# Altium project POVRotor.PrjPcb
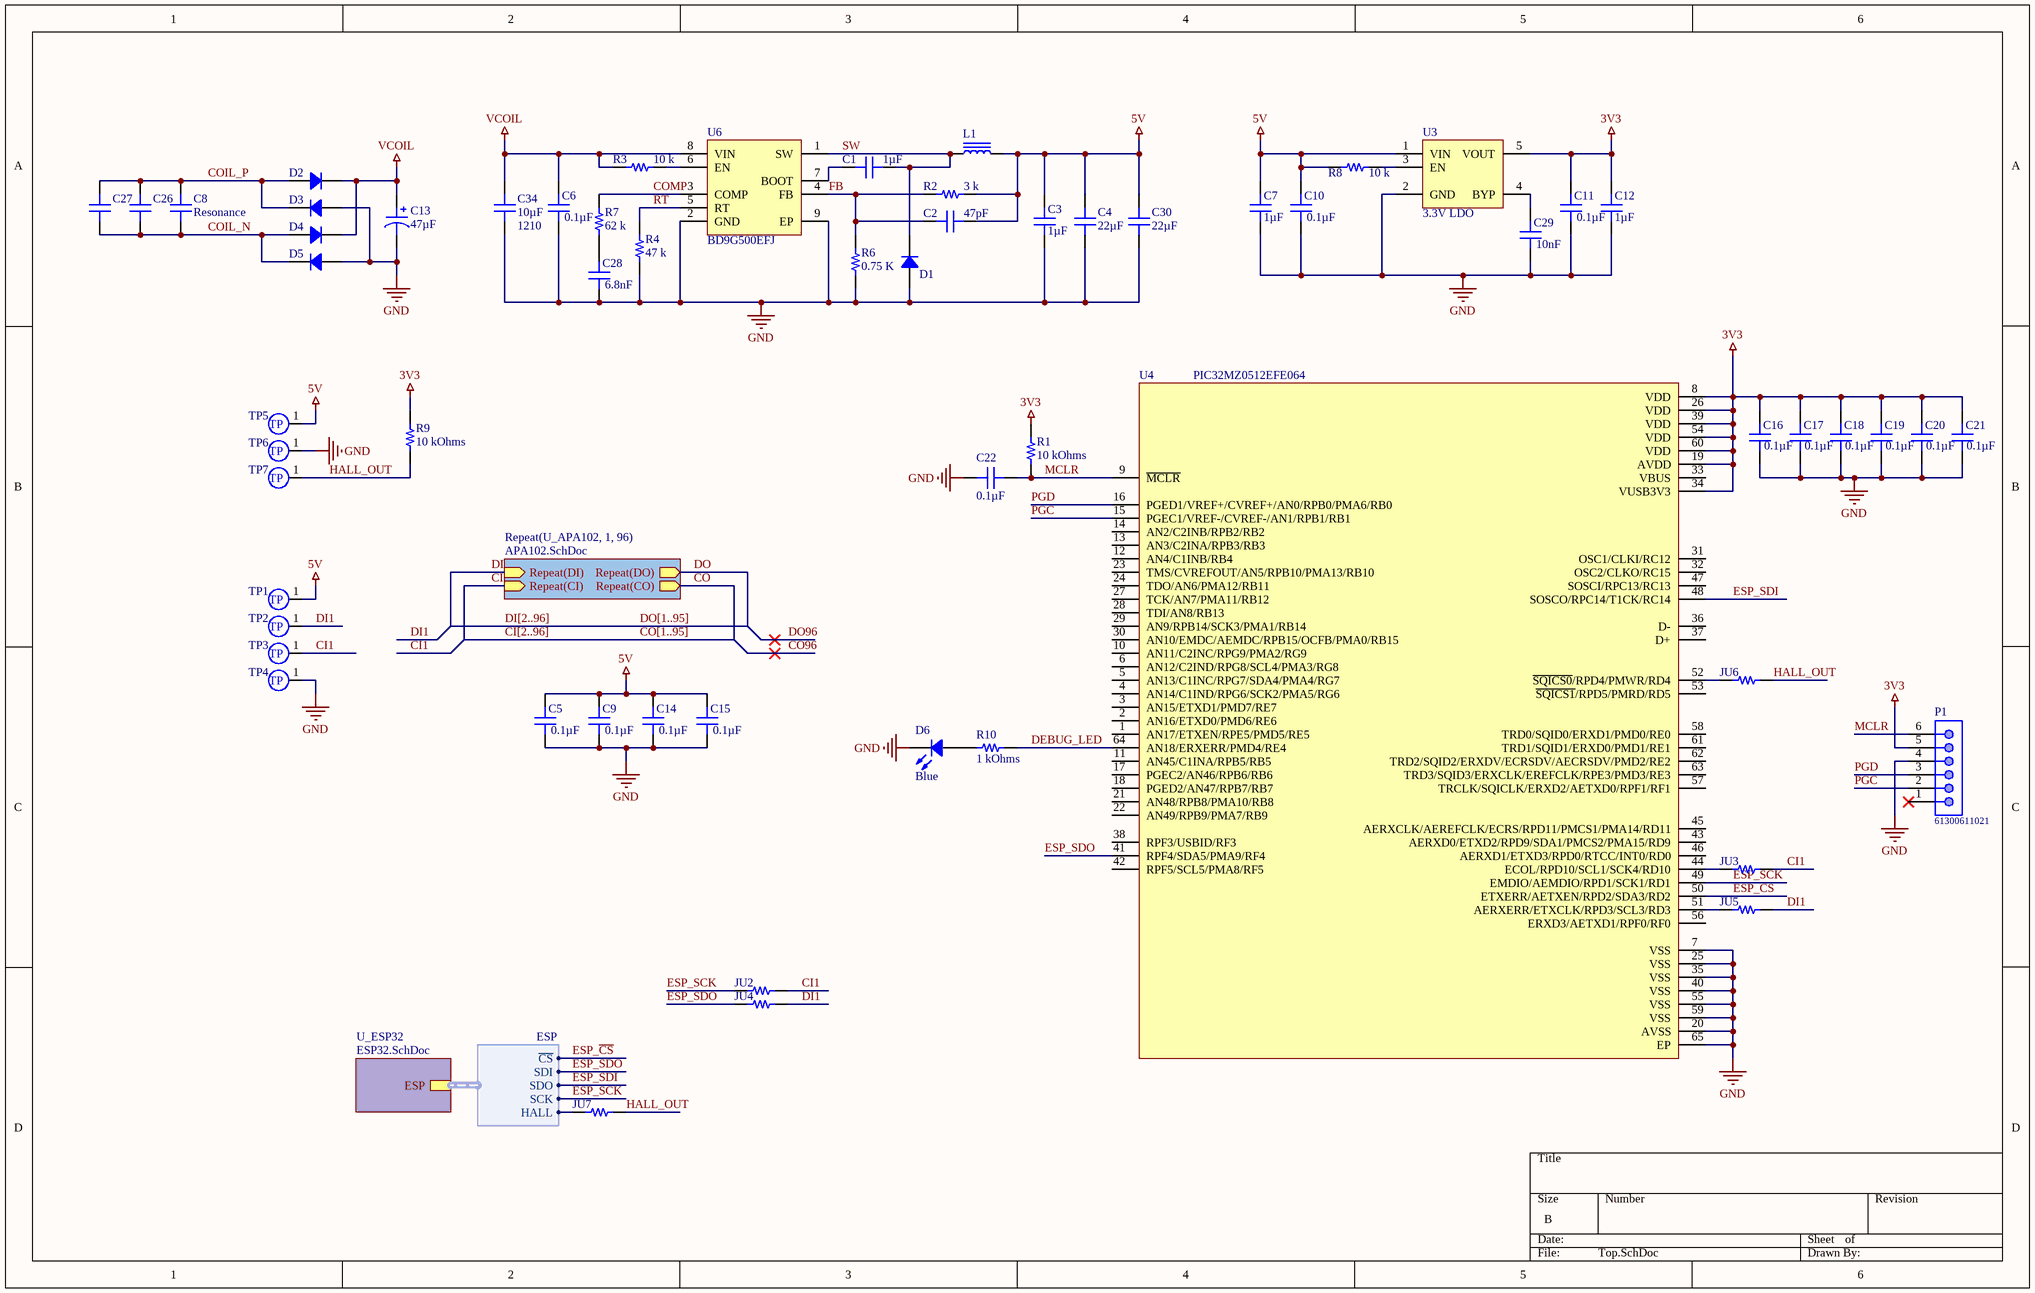
[diagram p0: Top.SchDoc]
2 sheets, 69 parts. Net scope: hierarchical (ports join the sheet entries above them; power ports are global).
Board file: POVRotor.PcbDoc
Sheets:
  Top.SchDoc
    U_ESP32 = ESP32.SchDoc

## Sheet Top.SchDoc
size B

### Parts
C1  1µF  [CAP 0603_1608]
C2  47pF  [CAP 0603_1608]
C3  1µF  [CAP 0603_1608]
C4  22µF  [CAP 0805_2012]
C5  0.1µF  [CAP 0603_1608]
C6  0.1µF  [CAP 0603_1608]
C7  1µF  [CAP 0603_1608]
C8  Resonance  [CAP 1206_3216 - 1.8MM]
C9  0.1µF  [CAP 0603_1608]
C10  0.1µF  [CAP 0603_1608]
C11  0.1µF  [CAP 0603_1608]
C12  1µF  [CAP 0603_1608]
C13  47µF  [CAP ALSMD 6.6MM H6.1MM]
C14  0.1µF  [CAP 0603_1608]
C15  0.1µF  [CAP 0603_1608]
C16  0.1µF  [CAP 0603_1608]
C17  0.1µF  [CAP 0603_1608]
C18  0.1µF  [CAP 0603_1608]
C19  0.1µF  [CAP 0603_1608]
C20  0.1µF  [CAP 0603_1608]
C21  0.1µF  [CAP 0603_1608]
C22  0.1µF  [CAP 0603_1608]
C26  Resonance  [CAP 1206_3216 - 1.8MM]  (value not drawn)
C27  Resonance  [CAP 1206_3216 - 1.8MM]  (value not drawn)
C28  6.8nF  [CAP 0603_1608]
C29  10nF  [CAP 0603_1608]
C30  22µF  [CAP 0805_2012]
C34  Device Package: 1210  [CAP 1210_3225 - 2.8MM]  (hidden comment: 10µF)
D1  STPS340UY  [DO214AA SMB]  (value not drawn)
D2  STPS340UY  [DO214AA SMB]  (value not drawn)
D3  STPS340UY  [DO214AA SMB]  (value not drawn)
D4  STPS340UY  [DO214AA SMB]  (value not drawn)
D5  STPS340UY  [DO214AA SMB]  (value not drawn)
D6  Blue  [LED 0603_1608 GREEN]
JU2  (no value)  [RES 0805_2012]
JU3  (no value)  [RES 0805_2012]
JU4  (no value)  [RES 0805_2012]
JU5  (no value)  [RES 0805_2012]
JU6  (no value)  [RES 0805_2012]
JU7  (no value)  [RES 0805_2012]
L1  MPL-AL5050-5R6  [MPL-AL5050-5R6]  (value not drawn)
P1  61300611021  [61300611021]
R1  10 kOhms  [RES 0603_1608]
R2  3 k  [RES 0603_1608]
R3  10 k  [RES 0603_1608]
R4  47 k  [RES 0603_1608]
R6  0.75 K  [RES 0603_1608]
R7  62 k  [RES 0603_1608]
R8  10 k  [RES 0603_1608]
R9  10 kOhms  [RES 0603_1608]
R10  1 kOhms  [RES 0603_1608]
TP1  TP  [TP]  (value not drawn)
TP2  TP  [TP]  (value not drawn)
TP3  TP  [TP]  (value not drawn)
TP4  TP  [TP]  (value not drawn)
TP5  TP  [TP]  (value not drawn)
TP6  TP  [TP]  (value not drawn)
TP7  TP  [TP]  (value not drawn)
U3  3.3V LDO  [TI SOT-23-5 DBV]
U4  PIC32MZ0512EFE064  [QFN50P900X900X100-65N]
U6  BD9G500EFJ  [SOP127P600X100-9N]

### Sub-sheets
Repeat(U_APA102, 1, 96) = APA102.SchDoc (file not in this document): Repeat(DI) (in), Repeat(CI) (in), Repeat(CO) (out), Repeat(DO) (out)
U_ESP32 = ESP32.SchDoc: ESP (harness ESP)

### Harnesses
ESP: ~{CS}, SDI, SDO, SCK, HALL

### Nets
3V3: C11.1 C12.2 C16.1 C17.1 C18.1 C19.1 C20.1 C21.1 P1.5 R1.2 R9.2 U3.5(VOUT) U4.8(VDD) U4.19(AVDD) U4.26(VDD) U4.34(VUSB3V3) U4.39(VDD) U4.54(VDD) U4.60(VDD)
5V: C2.1 C3.2 C4.2 C5.1 C7.2 C9.1 C10.1 C14.1 C15.1 C30.2 L1.2 R2.2 R8.2 TP1.1(TP) TP5.1(TP) U3.1(VIN)
GND: C3.1 C4.1 C5.2 C6.2 C7.1 C9.2 C10.2 C11.2 C12.1 C13.2 C14.2 C15.2 C16.2 C17.2 C18.2 C19.2 C20.2 C21.2 C22.2 C28.2 C29.2 C30.1 C34.2 D1.1 D3.1 D5.1 D6.2 P1.4 R4.2 R6.1 TP4.1(TP) TP6.1(TP) U3.2(GND) U4.7(VSS) U4.20(AVSS) U4.25(VSS) U4.35(VSS) U4.40(VSS) U4.55(VSS) U4.59(VSS) U4.65(EP) U6.2(GND) U6.9(EP)
VCOIL: C6.1 C13.1 C34.1 D2.2 D4.2 R3.2 U6.8(VIN)
CI: sheet Repeat(U_APA102, 1, 96)/Repeat(CI)
CI1: JU2.1 JU3.1 TP3.1(TP)
CO: sheet Repeat(U_APA102, 1, 96)/Repeat(CO)
COIL_N: C8.1 C26.1 C27.1 D4.1 D5.2
COIL_P: C8.2 C26.2 C27.2 D2.1 D3.2
COMP: R7.1 U6.3(COMP)
DEBUG_LED: R10.1 U4.64(AN18/ERXERR/PMD4/RE4)
DI: sheet Repeat(U_APA102, 1, 96)/Repeat(DI)
DI1: JU4.1 JU5.1 TP2.1(TP)
DO: sheet Repeat(U_APA102, 1, 96)/Repeat(DO)
ESP_~{CS}: U4.50(ETXERR/AETXEN/RPD2/SDA3/RD2) ; sheet U_ESP32/ESP.~{CS}  [project net ~{CS}]
ESP_HALL: JU7.2 ; sheet U_ESP32/ESP.HALL
ESP_SCK: JU2.2 U4.49(EMDIO/AEMDIO/RPD1/SCK1/RD1) ; sheet U_ESP32/ESP.SCK
ESP_SDI: U4.48(SOSCO/RPC14/T1CK/RC14) ; sheet U_ESP32/ESP.SDO
ESP_SDO: JU4.2 U4.41(RPF4/SDA5/PMA9/RF4) ; sheet U_ESP32/ESP.SDI
FB: C2.2 R2.1 R6.2 U6.4(FB)
HALL_OUT: JU6.1 JU7.1 R9.1 TP7.1(TP)
MCLR: C22.1 P1.6 R1.1 U4.9(~{MCLR})
PGC: P1.2 U4.15(PGEC1/VREF-/CVREF-/AN1/RPB1/RB1)
PGD: P1.3 U4.16(PGED1/VREF+/CVREF+/AN0/RPB0/PMA6/RB0)
RT: R4.1 U6.5(RT)
SW: C1.2 D1.2 L1.1 U6.1(SW)
NetC1_1: C1.1 U6.7(BOOT)
NetC28_1: C28.1 R7.2
NetC29_1: C29.1 U3.4(BYP)
NetD6_1: D6.1 R10.2
NetJU3_2: JU3.2 U4.44(ECOL/RPD10/SCL1/SCK4/RD10)
NetJU5_2: JU5.2 U4.51(AERXERR/ETXCLK/RPD3/SCL3/RD3)
NetJU6_2: JU6.2 U4.52(~{SQICS0}/RPD4/PMWR/RD4)
NetR3_1: R3.1 U6.6(EN)
NetR8_1: R8.1 U3.3(EN)

Not connected (* = marked no-connect by the designer): P1 1*; U4 1(AN17/ETXEN/RPE5/PMD5/RE5) 2(AN16/ETXD0/PMD6/RE6) 3(AN15/ETXD1/PMD7/RE7) 4(AN14/C1IND/RPG6/SCK2/PMA5/RG6) 5(AN13/C1INC/RPG7/SDA4/PMA4/RG7) 6(AN12/C2IND/RPG8/SCL4/PMA3/RG8) 10(AN11/C2INC/RPG9/PMA2/RG9) 11(AN45/C1INA/RPB5/RB5) 12(AN4/C1INB/RB4) 13(AN3/C2INA/RPB3/RB3) 14(AN2/C2INB/RPB2/RB2) 17(PGEC2/AN46/RPB6/RB6) 18(PGED2/AN47/RPB7/RB7) 21(AN48/RPB8/PMA10/RB8) 22(AN49/RPB9/PMA7/RB9) 23(TMS/CVREFOUT/AN5/RPB10/PMA13/RB10) 24(TDO/AN6/PMA12/RB11) 27(TCK/AN7/PMA11/RB12) 28(TDI/AN8/RB13) 29(AN9/RPB14/SCK3/PMA1/RB14) 30(AN10/EMDC/AEMDC/RPB15/OCFB/PMA0/RB15) 31(OSC1/CLKI/RC12) 32(OSC2/CLKO/RC15) 33(VBUS) 36(D-) 37(D+) 38(RPF3/USBID/RF3) 42(RPF5/SCL5/PMA8/RF5) 43(AERXD0/ETXD2/RPD9/SDA1/PMCS2/PMA15/RD9) 45(AERXCLK/AEREFCLK/ECRS/RPD11/PMCS1/PMA14/RD11) 46(AERXD1/ETXD3/RPD0/RTCC/INT0/RD0) 47(SOSCI/RPC13/RC13) 53(~{SQICS1}/RPD5/PMRD/RD5) 56(ERXD3/AETXD1/RPF0/RF0) 57(TRCLK/SQICLK/ERXD2/AETXD0/RPF1/RF1) 58(TRD0/SQID0/ERXD1/PMD0/RE0) 61(TRD1/SQID1/ERXD0/PMD1/RE1) 62(TRD2/SQID2/ERXDV/ECRSDV/AECRSDV/PMD2/RE2) 63(TRD3/SQID3/ERXCLK/EREFCLK/RPE3/PMD3/RE3)

### Buses and harness runs
bus CI[2..96] = CO[1..95]
bus DI[2..96] = DO[1..95]

### Library data of the parts
C1 C3 C7 C12 = GCJ188R71E105KA01D: CAP CER 1UF 25V X7R 0603; Manufacturer: Murata Electronics; Tolerance: ±10%; Part Number: GCJ188R71E105KA01D; Value: 1µF; Applications: Automotive, Boardflex Sensitive; Capacitance: 1µF; ComponentLink1Description: Datasheet; ComponentLink1URL: https://search.murata.co.jp/Ceramy/image/img/A01X/G101/ENG/GCJ188R71E105KA01-01.pdf; ComponentLink2Description: DigiKey Link; ComponentLink2URL: http://digikey.com/product-detail/en/murata-electronics/GCJ188R71E105KA01D/490-14409-1-ND/6606870; Device Package: 0603 (1608 Metric); Features: Soft Termination; LastUpdated: 13-Aug-20 10:24:06 AM; Lifecycle Status: Active; Minimum Order: 1; Mounting Type: Surface Mount, MLCC; Operating Temperature: -55°C ~ 125°C; Package / Case: 0603 (1608 Metric); Packaging: TapeAndReel; PartId: 9566; Part Status: Active; Price: 0.05; Ratings: AEC-Q200; Series: GCJ; Size / Dimension: 0.063" L x 0.031" W (1.60mm x 0.80mm); Supplier 1: DigiKey; Supplier Part Number 1: 490-14409-1-ND; Temperature Coefficient: X7R; Thickness (Max): 0.035" (0.90mm)
C2 = C1608NP02A470J080AA: CAP CER 47PF 100V NP0 0603; Manufacturer: TDK Corporation; Temperature Coefficient: C0G, NP0; Tolerance: ±5%; Part Number: C1608NP02A470J080AA; Value: 47pF; Applications: General Purpose; Capacitance: 47pF; ComponentLink1Description: Datasheet; ComponentLink1URL: https://product.tdk.com/info/en/catalog/datasheets/mlcc_commercial_hightemp_en.pdf?ref_disty=digikey; ComponentLink2Description: DigiKey Link; ComponentLink2URL: http://digikey.com/product-detail/en/tdk-corporation/C1608NP02A470J080AA/445-14125-1-ND/3955791; Device Package: 0603 (1608 Metric); Features: High Temperature; LastUpdated: 13-Aug-20 10:25:18 AM; Lifecycle Status: Active; Minimum Order: 1; Mounting Type: Surface Mount, MLCC; Operating Temperature: -55°C ~ 150°C; Package / Case: 0603 (1608 Metric); Packaging: TapeAndReel; PartId: 7049; Part Status: Active; Price: 0.04; Series: C; Size / Dimension: 0.063" L x 0.031" W (1.60mm x 0.80mm); Supplier 1: DigiKey; Supplier Part Number 1: 445-14125-1-ND; Thickness (Max): 0.035" (0.90mm)
C4 C30 = CL21A226MOQNNNE: CAP CER 22UF 16V X5R 0805; Manufacturer: Samsung Electro-Mechanics; Tolerance: ±20%; Part Number: CL21A226MOQNNNE; Value: 22µF; Applications: General Purpose; Capacitance: 22µF; ComponentLink1Description: Datasheet; ComponentLink1URL: http://www.samsungsem.com/kr/support/product-search/mlcc/CL21A226MOQNNNE.jsp; ComponentLink2Description: DigiKey Link; ComponentLink2URL: http://digikey.com/product-detail/en/samsung-electro-mechanics/CL21A226MOQNNNE/1276-2909-1-ND/3890995; Device Package: 0805 (2012 Metric); LastUpdated: 21-Jan-20 12:03:05 AM; Lifecycle Status: Active; Minimum Order: 1; Mounting Type: Surface Mount, MLCC; Operating Temperature: -55°C ~ 85°C; Package / Case: 0805 (2012 Metric); Packaging: TapeAndReel; PartId: 3052; Part Status: Active; Price: 0.11; Series: CL; Size / Dimension: 0.079" L x 0.049" W (2.00mm x 1.25mm); Supplier 1: DigiKey; Supplier Part Number 1: 1276-2909-1-ND; Temperature Coefficient: X5R; Thickness (Max): 0.055" (1.40mm); Voltage - Rated: 16V
C5 C6 C9-C11 C14-C22 = GCG188R92A104KA03D: CAP CER 0.1UF 100V 0603 EPOXY; Manufacturer: Murata Electronics; Temperature Coefficient: X8R; Tolerance: ±10%; Part Number: GCG188R92A104KA03D; Value: 0.1µF; Applications: Automotive; Capacitance: 0.1µF; ComponentLink1Description: Datasheet; ComponentLink1URL: https://search.murata.co.jp/Ceramy/image/img/A01X/G101/ENG/GCG188R92A104KA03-01.pdf; ComponentLink2Description: DigiKey Link; ComponentLink2URL: http://digikey.com/product-detail/en/murata-electronics/GCG188R92A104KA03D/490-18197-1-ND/9867926; Device Package: 0603 (1608 Metric); Features: Epoxy Mountable; LastUpdated: 21-Jan-20 12:01:59 AM; Lifecycle Status: Active; Minimum Order: 1; Mounting Type: Surface Mount, MLCC, Epoxy; Operating Temperature: -55°C ~ 150°C; Package / Case: 0603 (1608 Metric); Packaging: TapeAndReel; PartId: 9025; Part Status: Active; Price: 0.07; Ratings: AEC-Q200; Series: GCG; Size / Dimension: 0.063" L x 0.031" W (1.60mm x 0.80mm); Supplier 1: DigiKey; Supplier Part Number 1: 490-18197-1-ND; Thickness (Max): 0.035" (0.90mm); Voltage - Rated: 100V
C8 C26 C27 = HMF316B7103KFHT: CAP, MLCC, 1206/3216, 100V, X7R,; Manufacturer: Taiyo Yuden; Capacitance: 10000pF; Tolerance: ±10%; Part Number: HMF316B7103KFHT; Value: Resonance; Applications: Automotive, SMPS Filtering; ComponentLink1Description: Datasheet; ComponentLink1URL: https://ds.yuden.co.jp/TYCOMPAS/ut/detail?pn=HMF316B7103KFHT&u=M; ComponentLink2Description: DigiKey Link; ComponentLink2URL: http://digikey.com/product-detail/en/taiyo-yuden/HMF316B7103KFHT/587-6513-1-ND/10379206; Device Package: 1206 (3216 Metric); LastUpdated: 9/2/2020 1:05:22 AM; Lifecycle Status: Active; Minimum Order: 1; Mounting Type: Surface Mount, MLCC; Operating Temperature: -55°C ~ 125°C; Package / Case: 1206 (3216 Metric); Packaging: TapeAndReel; PartId: 22763; Part Status: Active; Price: 0.10; Ratings: AEC-Q200; Series: M; Size / Dimension: 0.126" L x 0.063" W (3.20mm x 1.60mm); Supplier 1: DigiKey; Supplier Part Number 1: 587-6513-1-ND; Temperature Coefficient: X7R; Thickness (Max): 0.049" (1.25mm); Voltage - Rated: 100V
C13 = EMHL160ARA470MF61G: ALUMINUM CAPACITOR; Manufacturer: United Chemi-Con; ESR (Equivalent Series Resistance): 1.2Ohm @ 100kHz; Lifetime @ Temp.: 2000 Hrs @ 125°C; Polarization: Polar; Ripple Current @ High Frequency: 110mA @ 100kHz; Ripple Current @ Low Frequency: 102.3mA @ 120Hz; Surface Mount Land Size: 0.260" L x 0.260" W (6.60mm x 6.60mm); Tolerance: ±20%; Voltage - Rated: 16V; Part Number: EMHL160ARA470MF61G; Applications: Automotive; Capacitance: 47µF; ComponentLink1Description: Datasheet; ComponentLink1URL: http://www.chemi-con.co.jp/cgi-bin/CAT_DB/SEARCH/cat_db_al.cgi?e=e&j=p&pdfname=mhl; ComponentLink2Description: DigiKey Link; ComponentLink2URL: http://digikey.com/product-detail/en/united-chemi-con/EMHL160ARA470MF61G/565-EMHL160ARA470MF61GCT-ND/10487181; Device Package: Radial, Can - SMD; Height - Seated (Max): 0.240" (6.10mm); LastUpdated: 9/2/2020 1:25:27 AM; Lifecycle Status: Active; Minimum Order: 1; Mounting Type: Surface Mount; Operating Temperature: -40°C ~ 125°C; Package / Case: Radial, Can - SMD; Packaging: TapeAndReel; PartId: 8133; Part Status: Active; Price: 0.15; Ratings: AEC-Q200; Series: AIchip™- MHL; Size / Dimension: 0.248" Dia (6.30mm); Supplier 1: DigiKey; Supplier Part Number 1: 565-EMHL160ARA470MF61GCT-ND; Value: 47µF
C28 C29 = GCG188R92A104KA03D: CAP CER 0.1UF 100V 0603 EPOXY; Manufacturer: Murata Electronics; Capacitance: 0.1µF; Temperature Coefficient: X8R; Tolerance: ±10%; Part Number: GCG188R92A104KA03D; Applications: Automotive; ComponentLink1Description: Datasheet; ComponentLink1URL: https://search.murata.co.jp/Ceramy/image/img/A01X/G101/ENG/GCG188R92A104KA03-01.pdf; ComponentLink2Description: DigiKey Link; ComponentLink2URL: http://digikey.com/product-detail/en/murata-electronics/GCG188R92A104KA03D/490-18197-1-ND/9867926; Device Package: 0603 (1608 Metric); Features: Epoxy Mountable; LastUpdated: 21-Jan-20 12:01:59 AM; Lifecycle Status: Active; Minimum Order: 1; Mounting Type: Surface Mount, MLCC, Epoxy; Operating Temperature: -55°C ~ 150°C; Package / Case: 0603 (1608 Metric); Packaging: TapeAndReel; PartId: 9025; Part Status: Active; Price: 0.07; Ratings: AEC-Q200; Series: GCG; Size / Dimension: 0.063" L x 0.031" W (1.60mm x 0.80mm); Supplier 1: DigiKey; Supplier Part Number 1: 490-18197-1-ND; Thickness (Max): 0.035" (0.90mm); Voltage - Rated: 100V
  C28: Value: 6.8nF
  C29: Value: 10nF
C34 = EMK325ABJ107MM-P: CAP CER 100UF 16V X5R 1210; Manufacturer: Taiyo Yuden; Capacitance: 100µF; Tolerance: ±20%; Part Number: EMK325ABJ107MM-P; Value: 10µF; Applications: General Purpose; ComponentLink1Description: Datasheet; ComponentLink1URL: https://ds.yuden.co.jp/TYCOMPAS/ut/detail?pn=EMK325ABJ107MM-P &u=M; ComponentLink2Description: DigiKey Link; ComponentLink2URL: http://digikey.com/product-detail/en/taiyo-yuden/EMK325ABJ107MM-P/587-5426-1-ND/7067102; LastUpdated: 21-Jan-20 12:30:21 AM; Lifecycle Status: Active; Minimum Order: 1; Mounting Type: Surface Mount, MLCC; Operating Temperature: -55°C ~ 85°C; Package / Case: 1210 (3225 Metric); Packaging: TapeAndReel; PartId: 24141; Part Status: Active; Price: 0.71; Series: M; Size / Dimension: 0.126" L x 0.098" W (3.20mm x 2.50mm); Supplier 1: DigiKey; Supplier Part Number 1: 587-5426-1-ND; Temperature Coefficient: X5R; Thickness (Max): 0.110" (2.80mm); Voltage - Rated: 16V
D1-D5 = STPS340UY: DIODE SCHOTTKY 40V 3A SMB; Manufacturer: STMicroelectronics; Current - Reverse Leakage @ Vr: 20µA @ 40V; Speed: Fast Recovery =< 500ns, > 200mA (Io); Voltage - Forward (Vf) (Max) @ If: 630mV @ 3A; Part Number: STPS340UY; ComponentLink1Description: Datasheet; ComponentLink1URL: http://www.st.com/content/ccc/resource/technical/document/datasheet/9d/f4/fa/9f/2c/39/45/91/CD00270569.pdf/files/CD00270569.pdf/jcr:content/translations/en.CD00270569.pdf; ComponentLink2Description: DigiKey Link; ComponentLink2URL: http://digikey.com/product-detail/en/stmicroelectronics/STPS340UY/497-13432-1-ND/3770079; Current - Average Rectified (Io): 3A; Diode Type: Schottky; LastUpdated: 9/2/2020 1:18:53 AM; Lifecycle Status: Active; Minimum Order: 1; Mounting Type: Surface Mount; Operating Temperature - Junction: -40°C ~ 150°C; Package / Case: DO-214AA, SMB; Packaging: TapeAndReel; PartId: 1402; Part Status: Active; Price: 0.30; Series: Automotive, AEC-Q101; Supplier 1: DigiKey; Supplier Part Number 1: 497-13432-1-ND; Supplier Device Package: SMB; Voltage - DC Reverse (Vr) (Max): 40V
D6 = XZCDGK53W-8VF: Blue LED; Manufacturer: SunLED; Color: Green; Configuration: Independent; Current - Test: 2mA; Lens Color: Colorless; Lens Size: 0.35mm Dia; Lens Style: Round with Domed Top; Lens Transparency: Clear; Millicandela Rating: 417mcd; Value: Green; Viewing Angle: 60°; Voltage - Forward (Vf) (Typ): 2.65V; Wavelength - Dominant: 525nm; Wavelength - Peak: 515nm; Part Number: XZCDGK53W-8VF; ComponentLink1Description: Datasheet; ComponentLink1URL: https://www.sunledusa.com/products/spec/XZCDGK53W-8VF.pdf; ComponentLink2Description: DigiKey Link; ComponentLink2URL: http://digikey.com/product-detail/en/sunled/XZCDGK53W-8VF/1497-XZCDGK53W-8VFCT-ND/10449792; Device Package: 0603 (1608 Metric); Height (Max): 1.10mm; LastUpdated: 21-Jan-20 3:12:09 AM; Lifecycle Status: Active; Minimum Order: 1; Mounting Type: Surface Mount; Package / Case: 0603 (1608 Metric); Packaging: Unknown; PartId: 938; Part Status: Active; Price: 0.18; Series: Ultra Low Current; Size / Dimension: 1.60mm L x 0.80mm W; Supplier 1: DigiKey; Supplier Part Number 1: 1497-XZCDGK53W-8VFCT-ND; Supplier Device Package: 2-SMD
JU2-JU7 = TLRZ2ATTD: Jumper; Manufacturer: KOA Speer Electronics, Inc.; Part Number: TLRZ2ATTD; ComponentLink1Description: Datasheet; ComponentLink1URL: http://www.koaspeer.com/catimages/Products/TLRZ/TLRZ.pdf; ComponentLink2Description: DigiKey Link; ComponentLink2URL: http://digikey.com/product-detail/en/koa-speer-electronics-inc/TLRZ2ATTD/2019-TLRZ2ATTDCT-ND/9847538; Composition: Metal Element; Device Package: 0805 (2012 Metric); Features: Automotive AEC-Q200, Current Sense; Height - Seated (Max): 0.022" (0.55mm); LastUpdated: 9/2/2020 1:15:24 AM; Lifecycle Status: Active; Minimum Order: 1; Number of Terminations: 2; Operating Temperature: -55°C ~ 170°C; Package / Case: 0805 (2012 Metric); Packaging: TapeAndReel; PartId: 27685; Part Status: Active; Price: 0.09; Ratings: AEC-Q200; Series: TLRZ; Size / Dimension: 0.079" L x 0.049" W (2.00mm x 1.25mm); Supplier 1: DigiKey; Supplier Part Number 1: 2019-TLRZ2ATTDCT-ND; Supplier Device Package: 0805; Tolerance: Jumper
L1 = MPL-AL5050-5R6: FIXED IND 5.6UH 6.8A 20 MOHM SMD; MF: Laird-Signal Integrity Products; MP: MGV05021R0M-10; SnapEDA_Link: https://www.snapeda.com/parts/MGV05021R0M-10/Laird/view-part/5881352/?ref=snap; Availability: In Stock; Purchase-URL: https://pricing.snapeda.com/search/part/MGV05021R0M-10/?ref=eda; Check_prices: https://www.snapeda.com/parts/MGV05021R0M-10/Laird/view-part/5881352/?ref=eda; Value: *; Package: Molded-2 Laird; Price: None
P1 = 6pin right angle header - no holes: WR-PHD Pin Header, THT, pitch 2.54mm, Single Row, Angled, 6p; Manufacturer: Wurth Elektronik; Pin Number: 6; Rated Current: 3A; Working Voltage: 250VAC; Withstanding Voltage: 500VAC; Contact Resistance: 20mOhm; ComponentLink1Description: Manufacturer; ComponentLink1URL: http://www.we-online.de; ComponentLink2Description: Datasheet; ComponentLink2URL: https://www.we-online.com/catalog/datasheet/61300611021.pdf; Manufacturer Part Number: 61300611021; Published Date: May 2020; Pitch: 2.54mm; Operating Temperature: -40 to +105degC; Mounting Technology: THT; Packaging: Bag; Gender: Pin Header; Row Number: Single; Orientation: Angled
R1 R9 = RNCS0603BKE10K0: RES 10K OHM 0.1% 1/16W 0603; Manufacturer: Stackpole Electronics Inc; Power (Watts): 0.063W, 1/16W; Temperature Coefficient: ±25ppm/°C; Part Number: RNCS0603BKE10K0; Value: 10 kOhms; ComponentLink1Description: Datasheet; ComponentLink1URL: https://www.seielect.com/catalog/sei-rncs_rnch.pdf; ComponentLink2Description: DigiKey Link; ComponentLink2URL: http://digikey.com/product-detail/en/stackpole-electronics-inc/RNCS0603BKE10K0/RNCS0603BKE10K0CT-ND/1800113; Composition: Thin Film; Device Package: 0603 (1608 Metric); Features: Anti-Corrosive, Automotive AEC-Q200, Moisture Resistant; Height - Seated (Max): 0.022" (0.55mm); LastUpdated: 13-Aug-20 10:37:13 AM; Lifecycle Status: Active; Minimum Order: 1; Number of Terminations: 2; Operating Temperature: -55°C ~ 155°C; Package / Case: 0603 (1608 Metric); Packaging: TapeAndReel; PartId: 4838; Part Status: Active; Price: 0.08; Ratings: AEC-Q200; Resistance: 10 kOhms; Series: RNCS; Size / Dimension: 0.061" L x 0.031" W (1.55mm x 0.80mm); Supplier 1: DigiKey; Supplier Part Number 1: RNCS0603BKE10K0CT-ND; Supplier Device Package: 0603; Tolerance: ±0.1%
R2 = RT0603DRD0740K2L: RES SMD 40.2KOHM 0.5% 1/10W 0603; Manufacturer: Yageo; Power (Watts): 0.1W, 1/10W; Resistance: 40.2 kOhms; Temperature Coefficient: ±25ppm/°C; Part Number: RT0603DRD0740K2L; Value: 3 k; ComponentLink1Description: Datasheet; ComponentLink1URL: https://www.yageo.com/upload/media/product/productsearch/datasheet/rchip/PYu-RT_1-to-0.01_RoHS_L_11.pdf; ComponentLink2Description: DigiKey Link; ComponentLink2URL: http://digikey.com/product-detail/en/yageo/RT0603DRD0740K2L/311-40.2KDCT-ND/1035817; Composition: Thin Film; Device Package: 0603 (1608 Metric); Height - Seated (Max): 0.022" (0.55mm); LastUpdated: 13-Aug-20 10:36:48 AM; Lifecycle Status: Active; Minimum Order: 1; Number of Terminations: 2; Operating Temperature: -55°C ~ 155°C; Package / Case: 0603 (1608 Metric); Packaging: TapeAndReel; PartId: 18076; Part Status: Active; Price: 0.02; Series: RT; Size / Dimension: 0.063" L x 0.031" W (1.60mm x 0.80mm); Supplier 1: DigiKey; Supplier Part Number 1: 311-40.2KDCT-ND; Supplier Device Package: 0603; Tolerance: ±0.5%
R3 R4 R7 R8 = RNCS0603BKE10K0: RES 10K OHM 0.1% 1/16W 0603; Manufacturer: Stackpole Electronics Inc; Power (Watts): 0.063W, 1/16W; Resistance: 10 kOhms; Temperature Coefficient: ±25ppm/°C; Part Number: RNCS0603BKE10K0; ComponentLink1Description: Datasheet; ComponentLink1URL: https://www.seielect.com/catalog/sei-rncs_rnch.pdf; ComponentLink2Description: DigiKey Link; ComponentLink2URL: http://digikey.com/product-detail/en/stackpole-electronics-inc/RNCS0603BKE10K0/RNCS0603BKE10K0CT-ND/1800113; Composition: Thin Film; Device Package: 0603 (1608 Metric); Features: Anti-Corrosive, Automotive AEC-Q200, Moisture Resistant; Height - Seated (Max): 0.022" (0.55mm); LastUpdated: 21-Jan-20 12:25:01 AM; Lifecycle Status: Active; Minimum Order: 1; Number of Terminations: 2; Operating Temperature: -55°C ~ 155°C; Package / Case: 0603 (1608 Metric); Packaging: TapeAndReel; PartId: 4838; Part Status: Active; Price: 0.08; Ratings: AEC-Q200; Series: RNCS; Size / Dimension: 0.061" L x 0.031" W (1.55mm x 0.80mm); Supplier 1: DigiKey; Supplier Part Number 1: RNCS0603BKE10K0CT-ND; Supplier Device Package: 0603; Tolerance: ±0.1%
  R3 R8: Value: 10 k
  R4: Value: 47 k
  R7: Value: 62 k
R6 = RMCF0603FT7K68: RES 7.68K OHM 1% 1/10W 0603; Manufacturer: Stackpole Electronics Inc; Power (Watts): 0.1W, 1/10W; Resistance: 7.68 kOhms; Temperature Coefficient: ±100ppm/°C; Part Number: RMCF0603FT7K68; Value: 0.75 K; ComponentLink1Description: Datasheet; ComponentLink1URL: https://www.seielect.com/catalog/sei-rmcf_rmcp.pdf; ComponentLink2Description: DigiKey Link; ComponentLink2URL: http://digikey.com/product-detail/en/stackpole-electronics-inc/RMCF0603FT7K68/RMCF0603FT7K68CT-ND/4425120; Composition: Thick Film; Device Package: 0603 (1608 Metric); Features: Automotive AEC-Q200; Height - Seated (Max): 0.022" (0.55mm); LastUpdated: 13-Aug-20 10:36:44 AM; Lifecycle Status: Active; Minimum Order: 1; Number of Terminations: 2; Operating Temperature: -55°C ~ 155°C; Package / Case: 0603 (1608 Metric); Packaging: CutTape; PartId: 20370; Part Status: Active; Price: 0.10; Ratings: AEC-Q200; Series: RMCF; Size / Dimension: 0.061" L x 0.031" W (1.55mm x 0.80mm); Supplier 1: DigiKey; Supplier Part Number 1: RMCF0603FT7K68CT-ND; Supplier Device Package: 0603; Tolerance: ±1%
R10 = RNCF0603DTE1K00: RES 1K OHM 0.5% 1/10W 0603; Manufacturer: Stackpole Electronics Inc; Power (Watts): 0.1W, 1/10W; Temperature Coefficient: ±25ppm/°C; Part Number: RNCF0603DTE1K00; Value: 1 kOhms; ComponentLink1Description: Datasheet; ComponentLink1URL: https://www.seielect.com/catalog/sei-rncf.pdf; ComponentLink2Description: DigiKey Link; ComponentLink2URL: http://digikey.com/product-detail/en/stackpole-electronics-inc/RNCF0603DTE1K00/RNCF0603DTE1K00CT-ND/9915086; Composition: Thin Film; Device Package: 0603 (1608 Metric); Features: Automotive AEC-Q200; Height - Seated (Max): 0.022" (0.55mm); LastUpdated: 21-Jan-20 12:14:28 AM; Lifecycle Status: Active; Minimum Order: 1; Number of Terminations: 2; Operating Temperature: -55°C ~ 155°C; Package / Case: 0603 (1608 Metric); Packaging: TapeAndReel; PartId: 26300; Part Status: Active; Price: 0.05; Ratings: AEC-Q200; Resistance: 1 kOhms; Series: RNCF; Size / Dimension: 0.061" L x 0.031" W (1.55mm x 0.80mm); Supplier 1: DigiKey; Supplier Part Number 1: RNCF0603DTE1K00CT-ND; Supplier Device Package: 0603; Tolerance: ±0.5%
TP1-TP7 = TP: Test point
U3 = MIC5504-3.3YM5
U4 = PIC32MZ0512EFE064-I/PT: 32-bit Microcontrollers - MCU 32-BIT MCU 512KB FL 128KB RAM, No Crypto; MF: Microchip; MP: PIC32MZ2048EFG064T-I/PT; Price: None; Value: *; SnapEDA_Link: https://www.snapeda.com/parts/PIC32MZ2048EFG064T-I/PT/Microchip/view-part/565997/?ref=snap; Package: TQFP-64 Microchip; Availability: Unavailable
U6 = BD9G500EFJ: 5A Buck

## Sheet ESP32.SchDoc
size A
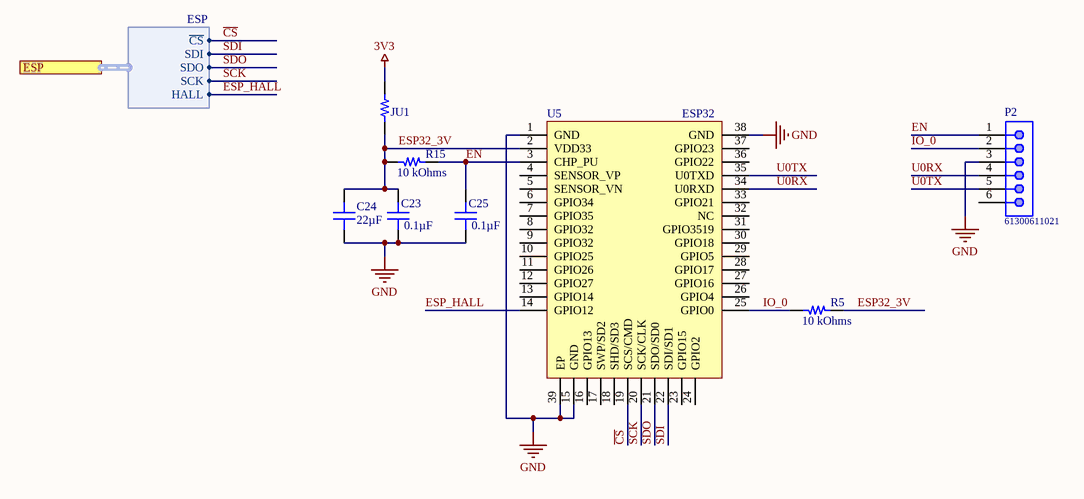
[diagram p1: ESP32.SchDoc]

### Parts
C23  0.1µF  [CAP 0603_1608]
C24  22µF  [CAP 0805_2012]
C25  0.1µF  [CAP 0603_1608]
JU1  (no value)  [RES 0805_2012]
P2  61300611021  [61300611021]
R5  10 kOhms  [RES 0603_1608]
R15  10 kOhms  [RES 0603_1608]
U5  ESP32  [Espressif ESP32-WROOM-32]

### Ports
ESP (harness ESP)

### Harnesses
ESP: ~{CS}, SDI, SDO, SCK, HALL

### Nets
3V3: JU1.2
GND: C23.2 C24.1 C25.2 P2.3 U5.1(GND) U5.15(GND) U5.38(GND) U5.39(EP)
~{CS}: U5.19(SCS/CMD) ; port ESP.~{CS}
EN: C25.1 P2.1 R15.1 U5.3(CHP_PU)
ESP32_3V: C23.1 C24.2 JU1.1 R5.1 R15.2 U5.2(VDD33)
ESP_HALL: U5.14(GPIO12) ; port ESP.HALL
IO_0: P2.2 R5.2 U5.25(GPIO0)
SCK: U5.20(SCK/CLK) ; port ESP.SCK  [project net ESP_SCK]
SDI: U5.22(SDI/SD1) ; port ESP.SDI  [project net ESP_SDO]
SDO: U5.21(SDO/SD0) ; port ESP.SDO  [project net ESP_SDI]
U0RX: P2.4 U5.34(U0RXD)
U0TX: P2.5 U5.35(U0TXD)

Not connected (* = marked no-connect by the designer): P2 6; U5 4(SENSOR_VP) 5(SENSOR_VN) 6(GPIO34) 7(GPIO35) 8(GPIO32) 9(GPIO32) 10(GPIO25) 11(GPIO26) 12(GPIO27) 13(GPIO14) 16(GPIO13) 17(SWP/SD2) 18(SHD/SD3) 23(GPIO15) 24(GPIO2) 26(GPIO4) 27(GPIO16) 28(GPIO17) 29(GPIO5) 30(GPIO18) 31(GPIO3519) 32(NC) 33(GPIO21) 36(GPIO22) 37(GPIO23)

### Library data of the parts
C23 C25 = GCG188R92A104KA03D: as C5 on sheet Top; Part Number: GCG188R92A104KA03D; Value: 0.1µF; Applications: Automotive; Capacitance: 0.1µF; ComponentLink1Description: Datasheet; ComponentLink1URL: https://search.murata.co.jp/Ceramy/image/img/A01X/G101/ENG/GCG188R92A104KA03-01.pdf; ComponentLink2Description: DigiKey Link; ComponentLink2URL: http://digikey.com/product-detail/en/murata-electronics/GCG188R92A104KA03D/490-18197-1-ND/9867926; Device Package: 0603 (1608 Metric); Features: Epoxy Mountable; LastUpdated: 21-Jan-20 12:01:59 AM; Lifecycle Status: Active; Minimum Order: 1; Mounting Type: Surface Mount, MLCC, Epoxy; Operating Temperature: -55°C ~ 150°C; Package / Case: 0603 (1608 Metric); Packaging: TapeAndReel; PartId: 9025; Part Status: Active; Price: 0.07; Ratings: AEC-Q200; Series: GCG; Size / Dimension: 0.063" L x 0.031" W (1.60mm x 0.80mm); Supplier 1: DigiKey; Supplier Part Number 1: 490-18197-1-ND; Thickness (Max): 0.035" (0.90mm); Voltage - Rated: 100V
C24 = CL21A226MOQNNNE: as C4 on sheet Top; Part Number: CL21A226MOQNNNE; Value: 22µF; Applications: General Purpose; Capacitance: 22µF; ComponentLink1Description: Datasheet; ComponentLink1URL: http://www.samsungsem.com/kr/support/product-search/mlcc/CL21A226MOQNNNE.jsp; ComponentLink2Description: DigiKey Link; ComponentLink2URL: http://digikey.com/product-detail/en/samsung-electro-mechanics/CL21A226MOQNNNE/1276-2909-1-ND/3890995; Device Package: 0805 (2012 Metric); LastUpdated: 21-Jan-20 12:03:05 AM; Lifecycle Status: Active; Minimum Order: 1; Mounting Type: Surface Mount, MLCC; Operating Temperature: -55°C ~ 85°C; Package / Case: 0805 (2012 Metric); Packaging: TapeAndReel; PartId: 3052; Part Status: Active; Price: 0.11; Series: CL; Size / Dimension: 0.079" L x 0.049" W (2.00mm x 1.25mm); Supplier 1: DigiKey; Supplier Part Number 1: 1276-2909-1-ND; Temperature Coefficient: X5R; Thickness (Max): 0.055" (1.40mm); Voltage - Rated: 16V
JU1 = TLRZ2ATTD: as JU2 on sheet Top; Part Number: TLRZ2ATTD; ComponentLink1Description: Datasheet; ComponentLink1URL: http://www.koaspeer.com/catimages/Products/TLRZ/TLRZ.pdf; ComponentLink2Description: DigiKey Link; ComponentLink2URL: http://digikey.com/product-detail/en/koa-speer-electronics-inc/TLRZ2ATTD/2019-TLRZ2ATTDCT-ND/9847538; Composition: Metal Element; Device Package: 0805 (2012 Metric); Features: Automotive AEC-Q200, Current Sense; Height - Seated (Max): 0.022" (0.55mm); LastUpdated: 9/2/2020 1:15:24 AM; Lifecycle Status: Active; Minimum Order: 1; Number of Terminations: 2; Operating Temperature: -55°C ~ 170°C; Package / Case: 0805 (2012 Metric); Packaging: TapeAndReel; PartId: 27685; Part Status: Active; Price: 0.09; Ratings: AEC-Q200; Series: TLRZ; Size / Dimension: 0.079" L x 0.049" W (2.00mm x 1.25mm); Supplier 1: DigiKey; Supplier Part Number 1: 2019-TLRZ2ATTDCT-ND; Supplier Device Package: 0805; Tolerance: Jumper
P2 = 6pin right angle header - no holes: as P1 on sheet Top; ComponentLink1Description: Manufacturer; ComponentLink1URL: http://www.we-online.de; ComponentLink2Description: Datasheet; ComponentLink2URL: https://www.we-online.com/catalog/datasheet/61300611021.pdf; Manufacturer Part Number: 61300611021; Published Date: May 2020; Pitch: 2.54mm; Operating Temperature: -40 to +105degC; Mounting Technology: THT; Packaging: Bag; Gender: Pin Header; Row Number: Single; Orientation: Angled
R5 R15 = RNCS0603BKE10K0: as R1 on sheet Top; Part Number: RNCS0603BKE10K0; Value: 10 kOhms; ComponentLink1Description: Datasheet; ComponentLink1URL: https://www.seielect.com/catalog/sei-rncs_rnch.pdf; ComponentLink2Description: DigiKey Link; ComponentLink2URL: http://digikey.com/product-detail/en/stackpole-electronics-inc/RNCS0603BKE10K0/RNCS0603BKE10K0CT-ND/1800113; Composition: Thin Film; Device Package: 0603 (1608 Metric); Features: Anti-Corrosive, Automotive AEC-Q200, Moisture Resistant; Height - Seated (Max): 0.022" (0.55mm); LastUpdated: 21-Jan-20 12:25:01 AM; Lifecycle Status: Active; Minimum Order: 1; Number of Terminations: 2; Operating Temperature: -55°C ~ 155°C; Package / Case: 0603 (1608 Metric); Packaging: TapeAndReel; PartId: 4838; Part Status: Active; Price: 0.08; Ratings: AEC-Q200; Resistance: 10 kOhms; Series: RNCS; Size / Dimension: 0.061" L x 0.031" W (1.55mm x 0.80mm); Supplier 1: DigiKey; Supplier Part Number 1: RNCS0603BKE10K0CT-ND; Supplier Device Package: 0603; Tolerance: ±0.1%

## Nets that join several sheets
3V3: Top (19 pins), ESP32 (JU1.2)
GND: Top (43 pins), ESP32 (8 pins)
~{CS}: Top (U4.50), ESP32 (U5.19)
ESP_HALL: Top (JU7.2), ESP32 (U5.14)
ESP_SCK: Top (JU2.2 U4.49), ESP32 (U5.20)
ESP_SDI: Top (U4.48), ESP32 (U5.21)
ESP_SDO: Top (JU4.2 U4.41), ESP32 (U5.22)

## Assembly variants
Main: not fitted JU1 JU2 JU3 JU4 JU5 JU6 JU7